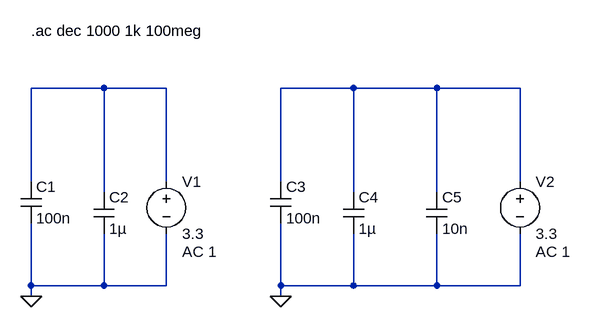
[diagram p0: schematic Draft5.asc]
Draft5.asc, the LTspice schematic file:
Version 4
SHEET 1 992 680
WIRE 272 -64 160 -64
WIRE 368 -64 272 -64
WIRE 656 -64 544 -64
WIRE 784 -64 656 -64
WIRE 912 -64 784 -64
WIRE 160 80 160 -64
WIRE 368 80 368 -64
WIRE 544 80 544 -64
WIRE 912 80 912 -64
WIRE 272 96 272 -64
WIRE 656 96 656 -64
WIRE 784 96 784 -64
WIRE 160 240 160 144
WIRE 272 240 272 160
WIRE 272 240 160 240
WIRE 368 240 368 160
WIRE 368 240 272 240
WIRE 544 240 544 144
WIRE 656 240 656 160
WIRE 656 240 544 240
WIRE 784 240 784 160
WIRE 784 240 656 240
WIRE 912 240 912 160
WIRE 912 240 784 240
WIRE 160 256 160 240
WIRE 544 256 544 240
FLAG 160 256 0
FLAG 544 256 0
SYMBOL cap 144 80 R0
SYMATTR InstName C1
SYMATTR Value 100n
SYMATTR SpiceLine Rser=0.01 Lser=0.8n
SYMBOL voltage 368 64 R0
WINDOW 123 24 124 Left 2
WINDOW 39 0 0 Left 0
SYMATTR InstName V1
SYMATTR Value 3.3
SYMATTR Value2 AC 1
SYMBOL cap 256 96 R0
SYMATTR InstName C2
SYMATTR Value 1µ
SYMATTR SpiceLine Rser=0.03 Lser=1n
SYMBOL cap 528 80 R0
SYMATTR InstName C3
SYMATTR Value 100n
SYMATTR SpiceLine Rser=0.01 Lser=0.8n
SYMBOL voltage 912 64 R0
WINDOW 123 24 124 Left 2
WINDOW 39 0 0 Left 0
SYMATTR InstName V2
SYMATTR Value 3.3
SYMATTR Value2 AC 1
SYMBOL cap 640 96 R0
SYMATTR InstName C4
SYMATTR Value 1µ
SYMATTR SpiceLine Rser=0.150 Lser=1n
SYMBOL cap 768 96 R0
SYMATTR InstName C5
SYMATTR Value 10n
SYMATTR SpiceLine Rser=0.01 Lser=0.8n
TEXT 160 -152 Left 2 !.ac dec 1000 1k 100meg

The netlist it stands for:
* Draft5.asc
C1 N001 0 100n Rser=0.01 Lser=0.8n
V1 N001 0 3.3 AC 1
C2 N001 0 1µ Rser=0.03 Lser=1n
C3 N002 0 100n Rser=0.01 Lser=0.8n
V2 N002 0 3.3 AC 1
C4 N002 0 1µ Rser=0.150 Lser=1n
C5 N002 0 10n Rser=0.01 Lser=0.8n
.ac dec 1000 1k 100meg
.backanno
.end